# Altium schematic sheet input power switching.SchDoc
size A4
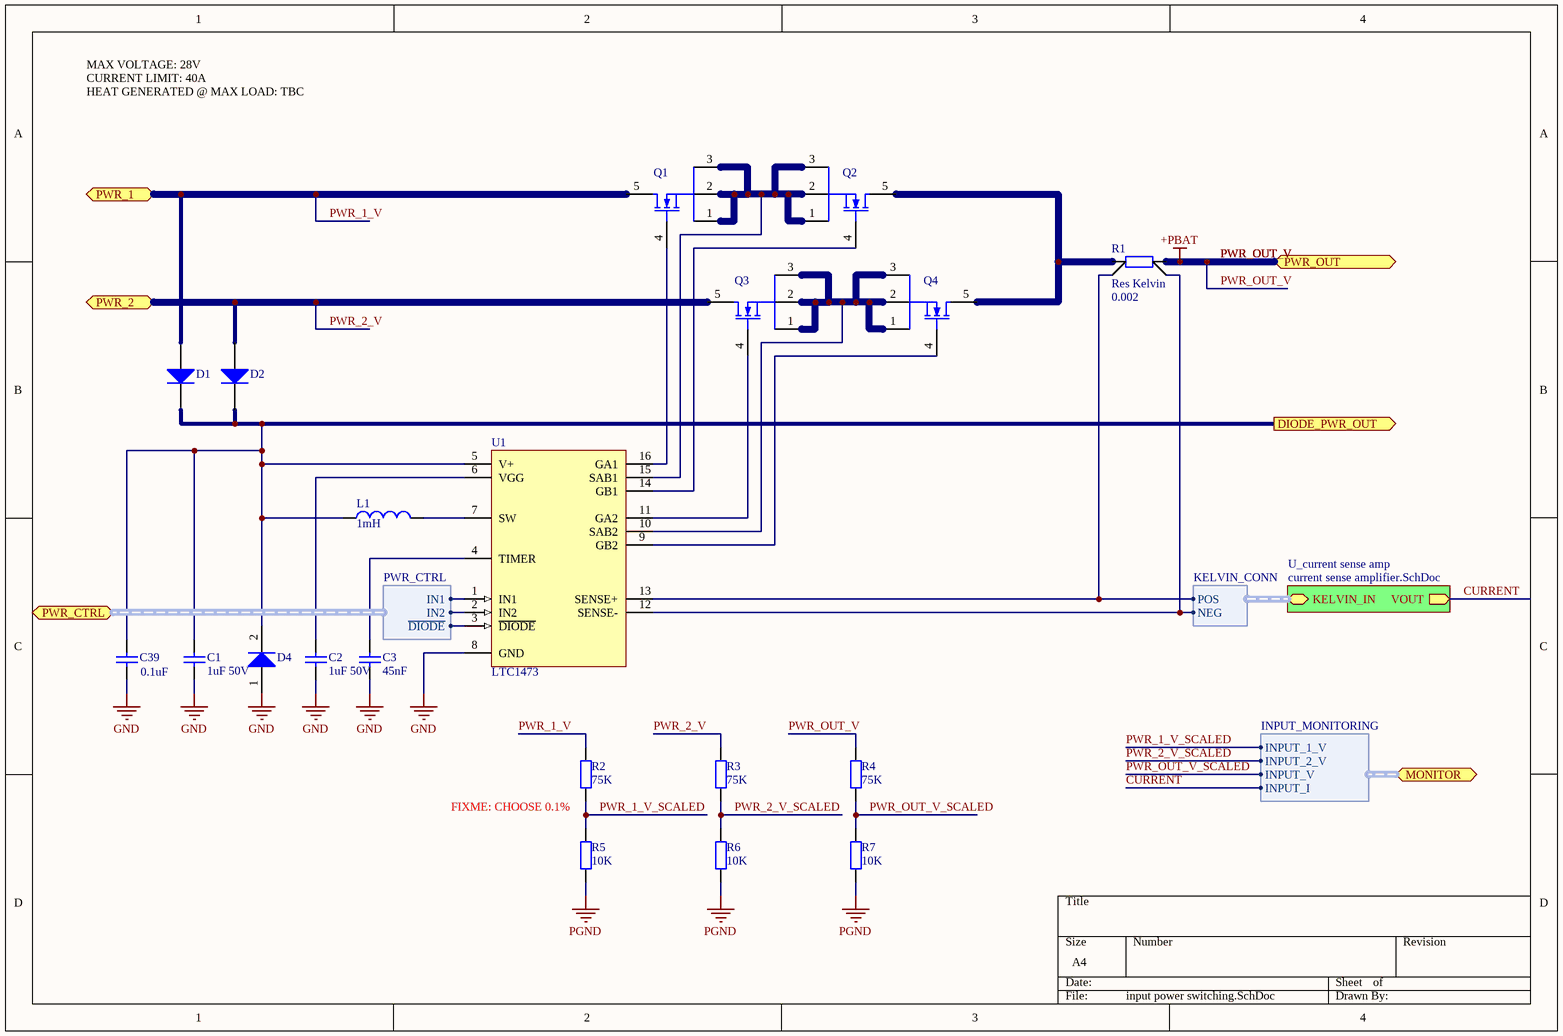
[diagram p0: input power switching.SchDoc]

## Parts
C1  value 1uF 50V  [C0603]  (hidden comment: Cap)
C2  value 1uF 50V  [C0603]  (hidden comment: Cap)
C3  value 45nF  [C0603]  (hidden comment: Cap)
C39  value 0.1uF  [C0603]  (hidden comment: Cap)
D1  Diode  [VS-10BQ030TRPBF]  (value not drawn)
D2  Diode  [VS-10BQ030TRPBF]  (value not drawn)
D4  Diode  [MMBD914LT1G]  (value not drawn)
L1  value 1mH  [744045102]  (hidden comment: Inductor)
Q1  PSMN1R7-30YL  [PSMN1R7-30YL]  (value not drawn)
Q2  PSMN1R7-30YL  [PSMN1R7-30YL]  (value not drawn)
Q3  PSMN1R7-30YL  [PSMN1R7-30YL]  (value not drawn)
Q4  PSMN1R7-30YL  [PSMN1R7-30YL]  (value not drawn)
R1  Res Kelvin  value 0.002  [WSR32L000FEA]  (net tie, no BOM)
R2  value 75K  [R0603]  (hidden comment: Res2)
R3  value 75K  [R0603]  (hidden comment: Res2)
R4  value 75K  [R0603]  (hidden comment: Res2)
R5  value 10K  [R0603]  (hidden comment: Res)
R6  value 10K  [R0603]  (hidden comment: Res)
R7  value 10K  [R0603]  (hidden comment: Res)
U1  LTC1473  [LTC1473]

## Sub-sheets
U_current sense amp = current sense amplifier.SchDoc: KELVIN_IN (harness KELVIN_CONN), VOUT (out)

## Ports
DIODE_PWR_OUT (out), MONITOR (harness INPUT_MONITORING), PWR_1, PWR_2, PWR_CTRL (harness PWR_CTRL), PWR_OUT

## Harnesses
KELVIN_CONN: POS, NEG
PWR_CTRL: IN1, IN2, ~{DIODE}
INPUT_MONITORING: INPUT_I, INPUT_1_V, INPUT_2_V, INPUT_V

## Nets
GND: C1.1 C2.1 C3.1 C39.1 D4.1(A) U1.8(GND)
PGND: R5.2 R6.2 R7.2
PWR_OUT_V: R4.1 ; port PWR_OUT  [also labelled +PBAT]
CURRENT: sheet U_current sense amp/VOUT, port MONITOR.INPUT_I
DIODE_PWR_OUT: C1.2 C39.2 D1.2(K) D2.2(K) D4.2(K) L1.1 U1.5(V+) ; port DIODE_PWR_OUT
PWR_1_V: D1.1(A) Q1.5(D) R2.2 ; port PWR_1
PWR_1_V_SCALED: R2.1 R5.1 ; port MONITOR.INPUT_1_V
PWR_2_V: D2.1(A) Q3.5(D) R3.2 ; port PWR_2
PWR_2_V_SCALED: R3.1 R6.1 ; port MONITOR.INPUT_2_V
PWR_OUT_V_SCALED: R4.1 R7.1 ; port MONITOR.INPUT_V
NetC2_2: C2.2 U1.6(VGG)
NetC3_2: C3.2 U1.4(TIMER)
NetL1_2: L1.2 U1.7(SW)
NetQ1_1: Q1.1(S) Q1.2(S) Q1.3(S) Q2.1(S) Q2.2(S) Q2.3(S) U1.15(SAB1)
NetQ1_4: Q1.4(G) U1.16(GA1)
NetQ2_4: Q2.4(G) U1.14(GB1)
NetQ2_5: Q2.5(D) Q4.5(D) R1.2
NetQ3_1: Q3.1(S) Q3.2(S) Q3.3(S) Q4.1(S) Q4.2(S) Q4.3(S) U1.10(SAB2)
NetQ3_4: Q3.4(G) U1.11(GA2)
NetQ4_4: Q4.4(G) U1.9(GB2)
NetR1_3: R1.3 U1.12(SENSE-) ; sheet U_current sense amp/KELVIN_IN.NEG
NetR1_4: R1.4 U1.13(SENSE+) ; sheet U_current sense amp/KELVIN_IN.POS
NetU1_1: U1.1(IN1) ; port PWR_CTRL.IN1
NetU1_2: U1.2(IN2) ; port PWR_CTRL.IN2
NetU1_3: U1.3(~{DIODE}) ; port PWR_CTRL.~{DIODE}

Not connected (* = marked no-connect by the designer): R1 1

## Notes on the sheet
- MAX VOLTAGE: 28V
- CURRENT LIMIT: 40A
- HEAT GENERATED @ MAX LOAD: TBC
- FIXME: CHOOSE 0.1%

## Library data of the parts
C1-C3 C39 = Cap: Capacitor; Published: 8-Jun-2000; LatestRevisionDate: 17-Jul-2002; LatestRevisionNote: Re-released for DXP Platform.; PackageReference: RAD-0.3; Publisher: Altium Limited
  C1 C2: farnell: 1845736
  C3: farnell: 1759031
  C39: farnell: 9406140
D1 D2 D4 = Diode: Default Diode; Published: 8-Jun-2000; LatestRevisionDate: 17-Jul-2002; LatestRevisionNote: Re-released for DXP Platform.; PackageVersion: Sep-1996; PackageReference: SMC; Publisher: Altium Limited; Code_JEDEC: DO-214-AB
  D1 D2: farnell: 9100687
  D4: farnell: 1431125
L1 = Inductor: Code_IEC: 1005; Published: 8-Jun-2000; LatestRevisionDate: 29-May-2009; LatestRevisionNote: IPC-7351 Footprint Added.; PackageReference: 0402-A; Publisher: Altium Limited; PackageDescription: Chip Inductor; Code_JEITA: 0402; farnell: 1800422
Q1-Q4 = PSMN1R7-30YL: NXP - PSMN1R7-30YL - MOSFET, N CH 30V 100A SOT669; farnell: 1699701
R1 = Res Kelvin: Resistor Kelvin; Published: 8-Jun-2000; LatestRevisionDate: 17-Jul-2002; LatestRevisionNote: Re-released for DXP Platform.; PackageReference: AXIAL-0.4; Publisher: Altium Limited; farnell: 1107461
R2-R7 = Res2: Resistor
  R2-R4: Published: 8-Jun-2000; LatestRevisionDate: 17-Jul-2002; LatestRevisionNote: Re-released for DXP Platform.; PackageReference: AXIAL-0.4; Publisher: Altium Limited; farnell: 9331522
  R5-R7: farnell: 1576297
U1 = LTC1473: IC SWITCH DVR PWRPATH DUAL16SSOP; digikey: LTC1473CGN#PBF-ND; farnell: 1273517